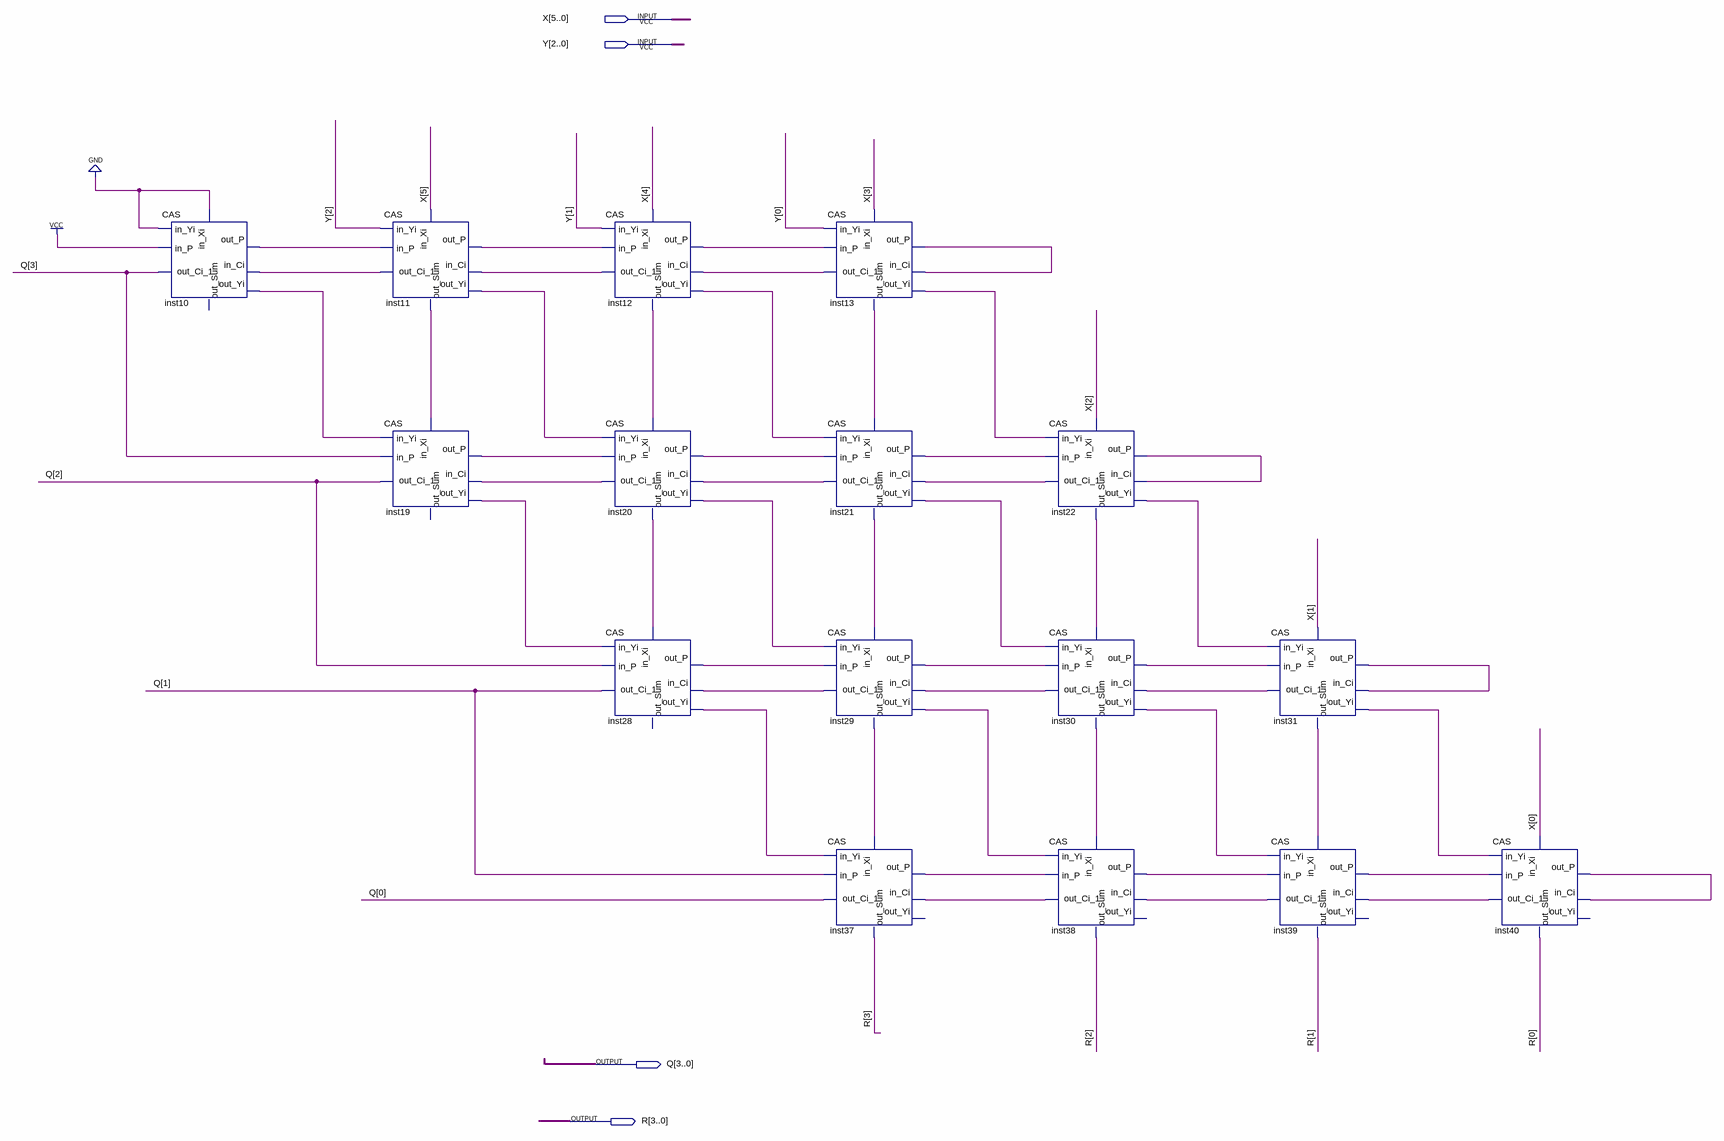
[diagram p0: schematic sheet]
// Quartus schematic div6_3.bdf as structural Verilog: 16 symbols, 4 pins
module div6_3 (
  input  [5:0] X,
  input  [2:0] Y,
  output [3:0] Q,
  output [3:0] R
);

  wire inst10_out_p, inst10_out_yi, inst11_out_ci_1, inst11_out_p, inst11_out_sum, inst11_out_yi,
       inst12_out_ci_1, inst12_out_p, inst12_out_sum, inst12_out_yi, inst13_out_ci_1, inst13_out_p,
       inst13_out_sum, inst13_out_yi, inst19_out_p, inst19_out_yi, inst20_out_ci_1, inst20_out_p,
       inst20_out_sum, inst20_out_yi, inst21_out_ci_1, inst21_out_p, inst21_out_sum, inst21_out_yi,
       inst22_out_ci_1, inst22_out_p, inst22_out_sum, inst22_out_yi, inst28_out_p, inst28_out_yi,
       inst29_out_ci_1, inst29_out_p, inst29_out_sum, inst29_out_yi, inst30_out_ci_1, inst30_out_p,
       inst30_out_sum, inst30_out_yi, inst31_out_ci_1, inst31_out_p, inst31_out_sum, inst31_out_yi,
       inst37_out_p, inst38_out_ci_1, inst38_out_p, inst39_out_ci_1, inst39_out_p, inst40_out_ci_1,
       inst40_out_p;

  CAS inst10 (
    .in_Xi(1'b0), .in_Yi(1'b0), .in_P(1'b1), .in_Ci(inst11_out_ci_1), .out_P(inst10_out_p),
    .out_Yi(inst10_out_yi), .out_Ci_1(Q[3]));  // open: out_Sum
  CAS inst11 (
    .in_Xi(X[5]), .in_Yi(Y[2]), .in_P(inst10_out_p), .in_Ci(inst12_out_ci_1), .out_P(inst11_out_p),
    .out_Yi(inst11_out_yi), .out_Sum(inst11_out_sum), .out_Ci_1(inst11_out_ci_1));
  CAS inst19 (
    .in_Xi(inst11_out_sum), .in_Yi(inst10_out_yi), .in_P(Q[3]), .in_Ci(inst20_out_ci_1),
    .out_P(inst19_out_p), .out_Yi(inst19_out_yi), .out_Ci_1(Q[2]));  // open: out_Sum
  CAS inst12 (
    .in_Xi(X[4]), .in_Yi(Y[1]), .in_P(inst11_out_p), .in_Ci(inst13_out_ci_1), .out_P(inst12_out_p),
    .out_Yi(inst12_out_yi), .out_Sum(inst12_out_sum), .out_Ci_1(inst12_out_ci_1));
  CAS inst20 (
    .in_Xi(inst12_out_sum), .in_Yi(inst11_out_yi), .in_P(inst19_out_p), .in_Ci(inst21_out_ci_1),
    .out_P(inst20_out_p), .out_Yi(inst20_out_yi), .out_Sum(inst20_out_sum), .out_Ci_1(inst20_out_ci_1));
  CAS inst28 (
    .in_Xi(inst20_out_sum), .in_Yi(inst19_out_yi), .in_P(Q[2]), .in_Ci(inst29_out_ci_1),
    .out_P(inst28_out_p), .out_Yi(inst28_out_yi), .out_Ci_1(Q[1]));  // open: out_Sum
  CAS inst13 (
    .in_Xi(X[3]), .in_Yi(Y[0]), .in_P(inst12_out_p), .in_Ci(inst13_out_p), .out_P(inst13_out_p),
    .out_Yi(inst13_out_yi), .out_Sum(inst13_out_sum), .out_Ci_1(inst13_out_ci_1));
  CAS inst21 (
    .in_Xi(inst13_out_sum), .in_Yi(inst12_out_yi), .in_P(inst20_out_p), .in_Ci(inst22_out_ci_1),
    .out_P(inst21_out_p), .out_Yi(inst21_out_yi), .out_Sum(inst21_out_sum), .out_Ci_1(inst21_out_ci_1));
  CAS inst29 (
    .in_Xi(inst21_out_sum), .in_Yi(inst20_out_yi), .in_P(inst28_out_p), .in_Ci(inst30_out_ci_1),
    .out_P(inst29_out_p), .out_Yi(inst29_out_yi), .out_Sum(inst29_out_sum), .out_Ci_1(inst29_out_ci_1));
  CAS inst37 (
    .in_Xi(inst29_out_sum), .in_Yi(inst28_out_yi), .in_P(Q[1]), .in_Ci(inst38_out_ci_1),
    .out_P(inst37_out_p), .out_Sum(R[3]), .out_Ci_1(Q[0]));  // open: out_Yi
  CAS inst22 (
    .in_Xi(X[2]), .in_Yi(inst13_out_yi), .in_P(inst21_out_p), .in_Ci(inst22_out_p), .out_P(inst22_out_p),
    .out_Yi(inst22_out_yi), .out_Sum(inst22_out_sum), .out_Ci_1(inst22_out_ci_1));
  CAS inst30 (
    .in_Xi(inst22_out_sum), .in_Yi(inst21_out_yi), .in_P(inst29_out_p), .in_Ci(inst31_out_ci_1),
    .out_P(inst30_out_p), .out_Yi(inst30_out_yi), .out_Sum(inst30_out_sum), .out_Ci_1(inst30_out_ci_1));
  CAS inst38 (
    .in_Xi(inst30_out_sum), .in_Yi(inst29_out_yi), .in_P(inst37_out_p), .in_Ci(inst39_out_ci_1),
    .out_P(inst38_out_p), .out_Sum(R[2]), .out_Ci_1(inst38_out_ci_1));  // open: out_Yi
  CAS inst31 (
    .in_Xi(X[1]), .in_Yi(inst22_out_yi), .in_P(inst30_out_p), .in_Ci(inst31_out_p), .out_P(inst31_out_p),
    .out_Yi(inst31_out_yi), .out_Sum(inst31_out_sum), .out_Ci_1(inst31_out_ci_1));
  CAS inst39 (
    .in_Xi(inst31_out_sum), .in_Yi(inst30_out_yi), .in_P(inst38_out_p), .in_Ci(inst40_out_ci_1),
    .out_P(inst39_out_p), .out_Sum(R[1]), .out_Ci_1(inst39_out_ci_1));  // open: out_Yi
  CAS inst40 (
    .in_Xi(X[0]), .in_Yi(inst31_out_yi), .in_P(inst39_out_p), .in_Ci(inst40_out_p), .out_P(inst40_out_p),
    .out_Sum(R[0]), .out_Ci_1(inst40_out_ci_1));  // open: out_Yi
endmodule
